# Altium schematic sheet CONFIG_MCU.SchDoc
size B; SheetNumber: 4; SheetTotal: 4
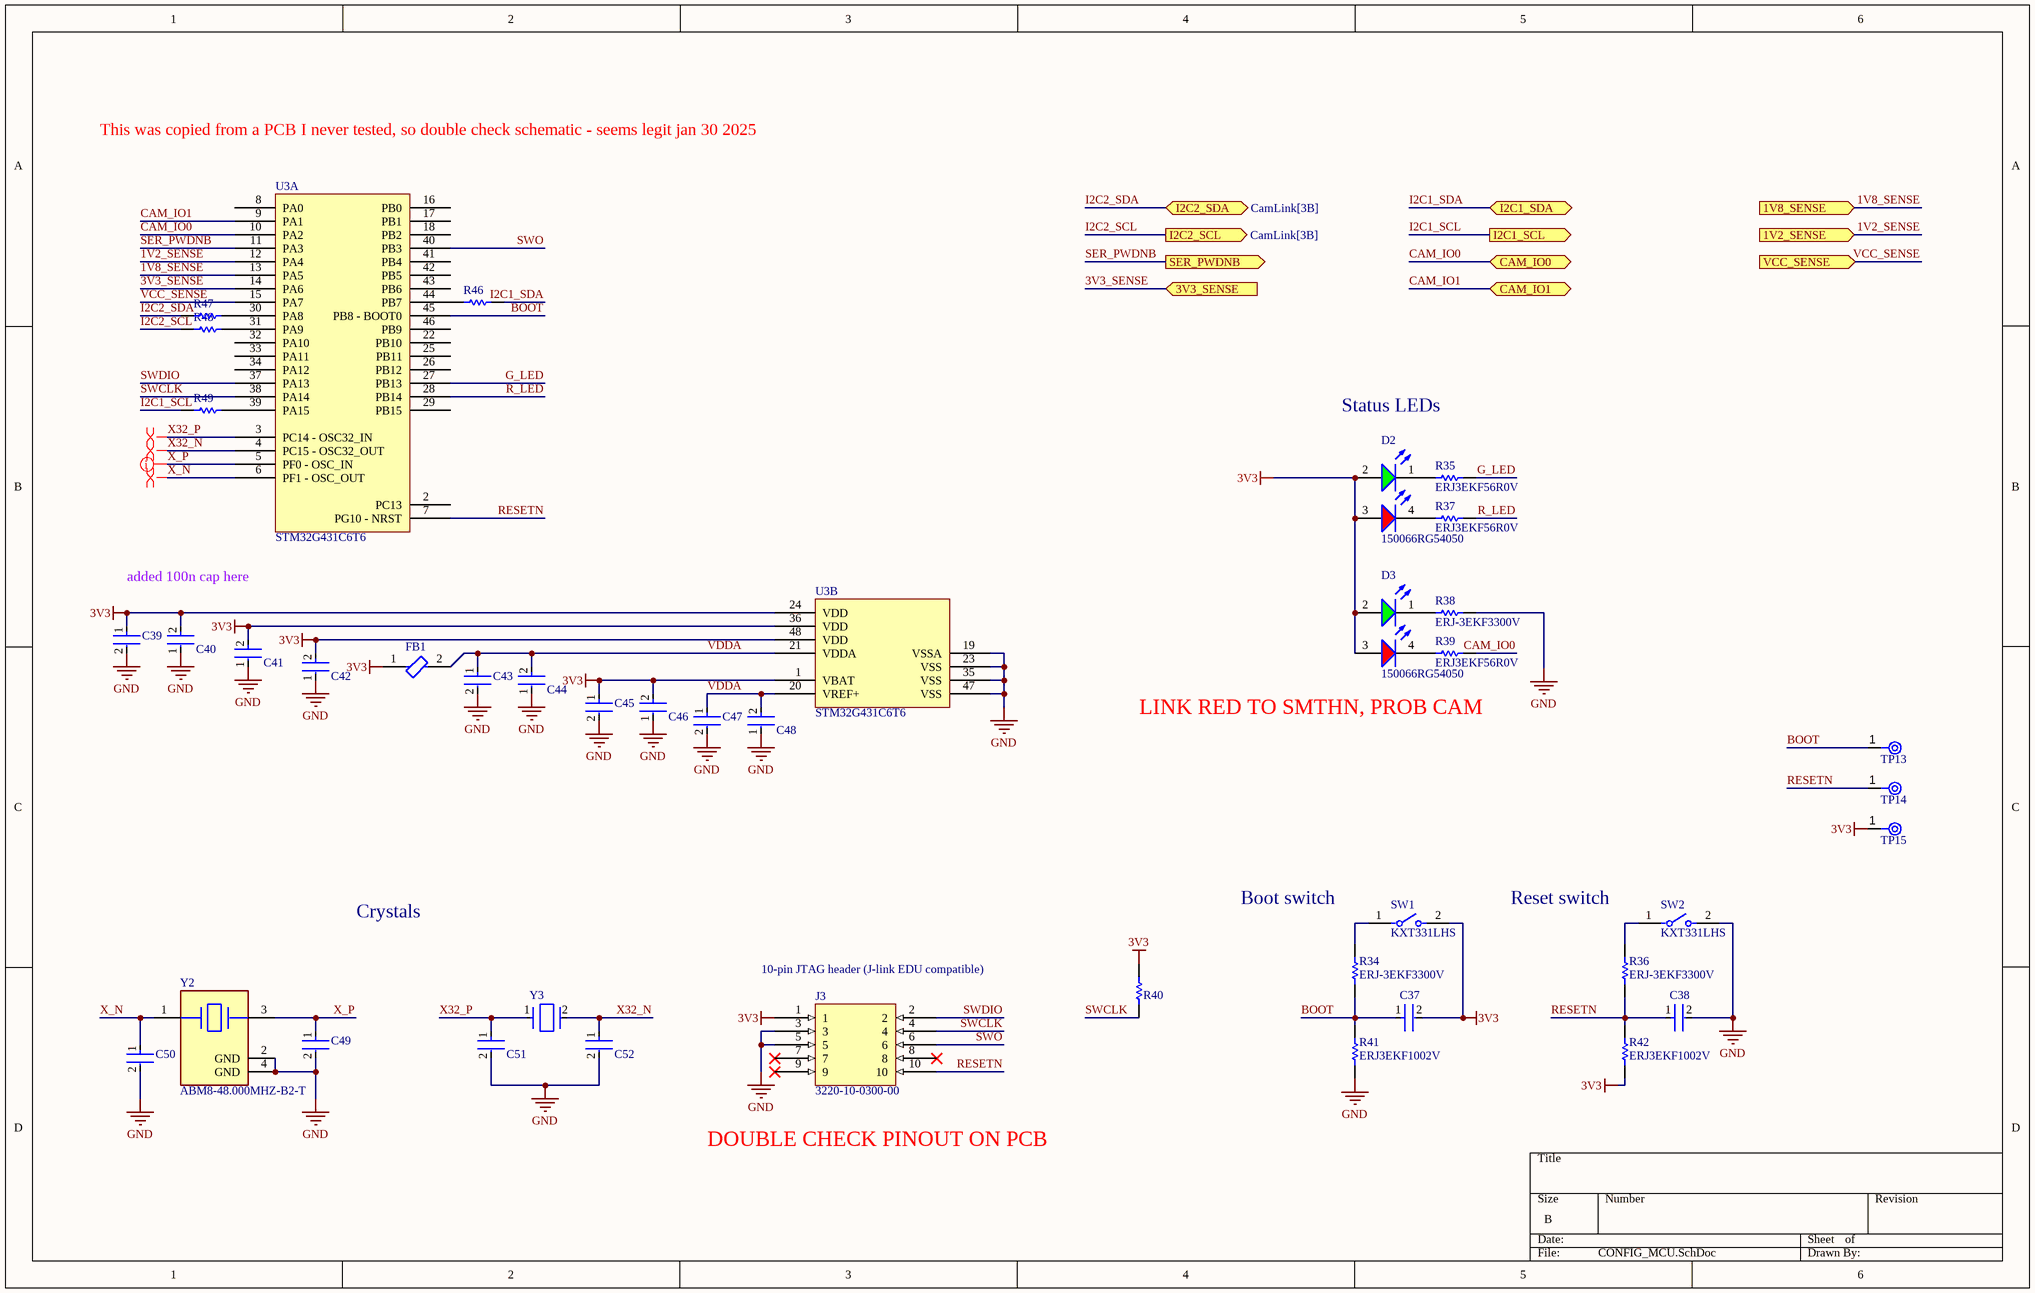
[diagram p0: CONFIG_MCU.SchDoc]

## Parts
C37  C0402C104K8PACTU  [FP-C0402-BB-MFG]  (value not drawn)
C38  C0402C104K8PACTU  [FP-C0402-BB-MFG]  (value not drawn)
C39  C1005X5R1A475K050BC  [FP-C1005-050-0_15-MFG]  (value not drawn)
C40  GRM155R71C104KA88D  [FP-GRM15-MFG]  (value not drawn)
C41  GRM155R71C104KA88D  [FP-GRM15-MFG]  (value not drawn)
C42  GRM155R71C104KA88D  [FP-GRM15-MFG]  (value not drawn)
C43  EMK105BJ105KV-F  [FP-0402-L_1_0_0_05-W_0_5-IPC_A]  (value not drawn)
C44  GRM155R71C104KA88D  [FP-GRM15-MFG]  (value not drawn)
C45  EMK105BJ105KV-F  [FP-0402-L_1_0_0_05-W_0_5-IPC_A]  (value not drawn)
C46  GRM155R71C104KA88D  [FP-GRM15-MFG]  (value not drawn)
C47  EMK105BJ105KV-F  [FP-0402-L_1_0_0_05-W_0_5-IPC_A]  (value not drawn)
C48  GRM155R71C104KA88D  [FP-GRM15-MFG]  (value not drawn)
C49  C0402C689C5GACTU  [FP-C0402-BB-MFG]  (value not drawn)
C50  C0402C689C5GACTU  [FP-C0402-BB-MFG]  (value not drawn)
C51  04025A180FAT2A  [FP-0402-L_1_0_1-W_0_5_0_1-IPC_A]  (value not drawn)
C52  04025A180FAT2A  [FP-0402-L_1_0_1-W_0_5_0_1-IPC_A]  (value not drawn)
D2  150066RG54050  [WL-SBCD_0606]
D3  150066RG54050  [WL-SBCD_0606]
FB1  BLM15PX601SN1D  [FP-BLM15-0_05-MFG]  (value not drawn)
J3  3220-10-0300-00  [3220-10-0300-00-Footprint-1]
R34  ERJ-3EKF3300V  [RESC1608X55X30LL15T15]
R35  ERJ3EKF56R0V  [RESC1608X55X30NL15T15]
R36  ERJ-3EKF3300V  [RESC1608X55X30LL15T15]
R37  ERJ3EKF56R0V  [RESC1608X55X30NL15T15]
R38  ERJ-3EKF3300V  [RESC1608X55X30LL15T15]
R39  ERJ3EKF56R0V  [RESC1608X55X30NL15T15]
R40  ERJ3EKF1002V  [RESC1609X55X30LL15T15]  (value not drawn)
R41  ERJ3EKF1002V  [RESC1609X55X30LL15T15]
R42  ERJ3EKF1002V  [RESC1609X55X30LL15T15]
R46  RC0402JR-070RL  [RESC1005X40X25NL05T10]  (value not drawn)
R47  RC0402JR-070RL  [RESC1005X40X25NL05T10]  (value not drawn)
R48  RC0402JR-070RL  [RESC1005X40X25NL05T10]  (value not drawn)
R49  RC0402JR-070RL  [RESC1005X40X25NL05T10]  (value not drawn)
SW1  KXT331LHS  [FP-KXT331LHS-MFG]
SW2  KXT331LHS  [FP-KXT331LHS-MFG]
TP13  TPAD6R  [New footprint 1]  (value not drawn)
TP14  TPAD6R  [New footprint 1]  (value not drawn)
TP15  TPAD6R  [New footprint 1]  (value not drawn)
U3  STM32G431C6T6  [TSQFP50P900X900X160-48N]  (parts A,B of 2)
Y2  ABM8-48.000MHZ-B2-T  [FP-ABM8-MFG]
Y3  ECS-.327-12.5-1210-TR  [FP-ECX-1210-MFG]  (value not drawn)

## Ports
1V2_SENSE (in, see CamLink[3B], GMSL_SERIALIZER[1B]), 1V8_SENSE (in, see CamLink[3B], GMSL_SERIALIZER[1B]), 3V3_SENSE (in, see CamLink[3B], 3V3_REG[3B]), CAM_IO0 (bidir, see CamLink[3B]), CAM_IO1 (bidir, see CamLink[3B]), I2C1_SCL (out, see CamLink[3B]), I2C1_SDA (bidir, see CamLink[3B]), I2C2_SCL (out, see CamLink[3B]), I2C2_SDA (bidir, see CamLink[3B]), SER_PWDNB (out, see CamLink[3B]), VCC_SENSE (in, see CamLink[3B], GMSL_SERIALIZER[1B])

## Nets
3V3: C37.2 C39.1 C40.2 C41.2 C42.2 C45.1 C46.2 D2.2(A) D2.3(A) D3.2(A) D3.3(A) FB1.1 J3.1 R40.1 R42.1 SW1.2 TP15.1(TP) U3.1(VBAT) U3.24(VDD) U3.36(VDD) U3.48(VDD)
GND: C38.2 C39.2 C40.1 C41.1 C42.1 C43.2 C44.1 C45.2 C46.1 C47.2 C48.1 C49.2 C50.2 C51.2 C52.2 J3.3 J3.5 R38.2 R41.1 SW2.2 U3.19(VSSA) U3.23(VSS) U3.35(VSS) U3.47(VSS) Y2.2(GND) Y2.4(GND)
1V2_SENSE: U3.12(PA4) ; port 1V2_SENSE
1V8_SENSE: U3.13(PA5) ; port 1V8_SENSE
3V3_SENSE: U3.14(PA6) ; port 3V3_SENSE
BOOT: C37.1 R34.1 R41.2 TP13.1(TP) U3.45(PB8_-_BOOT0)
CAM_IO0: R39.1 U3.10(PA2) ; port CAM_IO0
CAM_IO1: U3.9(PA1) ; port CAM_IO1
G_LED: R35.1 U3.27(PB13)
I2C1_SCL: R49.1 ; port I2C1_SCL
I2C1_SDA: R46.2 ; port I2C1_SDA
I2C2_SCL: R48.1 ; port I2C2_SCL
I2C2_SDA: R47.1 ; port I2C2_SDA
R_LED: R37.1 U3.28(PB14)
RESETN: C38.1 J3.10 R36.1 R42.2 TP14.1(TP) U3.7(PG10_-_NRST)
SER_PWDNB: U3.11(PA3) ; port SER_PWDNB
SWCLK: J3.4 R40.2 U3.38(PA14)
SWDIO: J3.2 U3.37(PA13)
SWO: J3.6 U3.40(PB3)
VCC_SENSE: U3.15(PA7) ; port VCC_SENSE
VDDA: C43.1 C44.2 C47.1 C48.2 FB1.2 U3.20(VREF+) U3.21(VDDA)
X32_N: C52.1 U3.4(PC15_-_OSC32_OUT) Y3.2(Out/In)
X32_P: C51.1 U3.3(PC14_-_OSC32_IN) Y3.1(In/Out)
X_N: C50.1 U3.6(PF1_-_OSC_OUT) Y2.1
X_P: C49.1 U3.5(PF0_-_OSC_IN) Y2.3
NetD2_1: D2.1(K) R35.2
NetD2_4: D2.4(K) R37.2
NetD3_1: D3.1(K) R38.1
NetD3_4: D3.4(K) R39.2
NetR34_2: R34.2 SW1.1
NetR36_2: R36.2 SW2.1
NetR46_1: R46.1 U3.44(PB7)
NetR47_2: R47.2 U3.30(PA8)
NetR48_2: R48.2 U3.31(PA9)
NetR49_2: R49.2 U3.39(PA15)

Not connected (* = marked no-connect by the designer): J3 7* 8* 9*; U3 2(PC13) 8(PA0) 16(PB0) 17(PB1) 18(PB2) 22(PB10) 25(PB11) 26(PB12) 29(PB15) 32(PA10) 33(PA11) 34(PA12) 41(PB4) 42(PB5) 43(PB6) 46(PB9)

## Layout directives
differential pair: X32_N, X32_P, X_N, X_P

## Notes on the sheet
- This was copied from a PCB I never tested, so double check schematic - seems legit jan 30 2025
- Status LEDs
- added 100n cap here
- LINK RED TO SMTHN, PROB CAM
- Boot switch
- Reset switch
- Crystals
- (near J3) 10-pin JTAG header (J-link EDU compatible)
- DOUBLE CHECK PINOUT ON PCB

## Library data of the parts
C37 C38 = CMP-2008-02046-2: CAP CER 0.1UF 10V X5R 0402; Manufacturer: Kemet; Material: Ceramic; Capacitance: 0.10 μF; Temperature Coefficient: 15%; Tolerance: 0.1; Value: 0.10 μF; Package: C0402-BB; Temperature: -55°C to +125°C; ComponentLink2Description: Datasheet; Temperature Characteristic: X5R; Device Class L1: Passive Components; Height: 0.55mm; Lead Free: Yes; ComponentLink2URL: https://content.kemet.com/datasheets/KEM_C1002_X7R_SMD.pdf; Device Class L2: Capacitors; Temperature Range Low: -55°C; Temperature Range High: +125°C; RoHS: TRUE; Octopart: https://octopart.com/c0402c104k8pactu-kemet-140039; Automotive: No; Mouser Description: Capacitor 100 nF 10 VDC 0402; Category: Cap; Voltage Rating: 10 V; Digikey Description: CAP CER 0.1UF 10V X5R 0402; Ipc Land Pattern Name: CAPC10050X50; Device Class L3: Ceramic Capacitors; Manufacturer Part Number: C0402C104K8PACTU
C39 = CMP-2000-05997-2: CAP CER 4.7UF 10V X5R 0402; Dielectric Material: Ceramic; Tolerance: 10%; Series: C; Package Quantity: 10000; Max Operating Temperature: 85°C; Case Code (Imperial): 0402; Lead Free: Lead Free; Voltage Rating (DC): 10V; Packaging: Cut Tape; Voltage Rating: 10V; Min Operating Temperature: -55°C; Dielectric: X5R; Thickness: 0.022inch; Width: 0.02inch; Case/Package: 0402; Case Code (Metric): 1005; Capacitance: 4.7uF; Length: 0.039inch; RoHS Compliant: Yes; REACH SVHC: No SVHC; Mount: Surface Mount
C40-C42 C44 C46 C48 = CMP-2100-03641-2: CAP CER 0.1UF 16V X7R 0402; Manufacturer: Murata; Standoff Height: 0mm; Tolerance: 10%; Voltage Rating: 16Vdc; Material: Ceramic; Capacitance: 0.10μF; Value: 0.10μF; RoHS: TRUE; Manufacturer Part Number: GRM155R71C104KA88D; Temperature Characteristic: X7R; Octopart: https://octopart.com/grm155r71c104ka88d-murata-196880; Digikey Description: CAP CER 0.1UF 16V X7R 0402; Device Class L3: Ceramic Capacitors; Height: 0.55mm; ComponentLink2Description: Datasheet; Temperature Range Low: -55°C; Ipc Land Pattern Name: CAPC10050X219; ComponentLink2URL: https://search.murata.co.jp/Ceramy/image/img/A01X/G101/ENG/GRM155R71H471KA01-01A.pdf; Device Class L1: Passive Components; Lead Free: yes; Category: Cap; Package: GRM15; Temperature: -55°C to +125°C; Device Class L2: Capacitors; Temperature Range High: +125°C; Mouser Description: 0402 0.1 uF 16V ±10 % Tolerance X7R SMT Multilayer Ceramic Capacitor
C43 C45 C47 = CMP-14477-000104-2: None; Tolerance: 10%; Voltage Rating: 16V; Dielectric: X5R; Capacitance: 1uF; Packaging: Tape and Reel; Depth: 0.5mm; Mount: Surface Mount; Thickness: 0.022inch; Package Quantity: 1; Min Operating Temperature: -55°C; Series: M; Voltage Rating (DC): 16V; Termination: SMD/SMT; Case/Package: 0402; Number of Pins: 2; Case Code (Imperial): 0402; Length: 1mm; Halogen Free: Halogen Free; Case Code (Metric): 1005; Width: 0.02inch; RoHS Compliant: Yes; Radiation Hardening: No; Max Operating Temperature: 85°C; Height: 0.5mm; Construction: Flat
C49 C50 = CMP-1034-00517-3: CAP CER 6.8PF 50V NP0 0402; Manufacturer: Kemet; Material: Ceramic; Temperature Characteristic: C0G; Tolerance: 0.25 pF; Temperature Coefficient: 15%; ComponentLink2URL: https://content.kemet.com/datasheets/KEM_C1002_X7R_SMD.pdf; Octopart: https://octopart.com/c0402c689c5gactu-kemet-9143567; RoHS: TRUE; Temperature: -55°C to +125°C; Device Class L2: Capacitors; ComponentLink2Description: Datasheet; Mouser Description: Cap Ceramic 6.8pF 50V C0G 0.25pF SMD 0402 125°C Paper T/R; Device Class L3: Ceramic Capacitors; Digikey Description: CAP CER 6.8PF 50V NP0 0402; Temperature Range High: +125°C; Package: C0402-BB; Voltage Rating: 50 V; Height: 0.55mm; Ipc Land Pattern Name: CAPC10050X50; Value: 6.8 pF; Device Class L1: Passive Components; Category: Cap; Manufacturer Part Number: C0402C689C5GACTU; Capacitance: 6.8 pF; Lead Free: Yes; Automotive: No; Temperature Range Low: -55°C
C51 C52 = CMP-2008-02590-2: General Purpose Ceramic Capacitor, 0402, 18pF, 1%, C0G, 30ppm/°C, 50V; Depth: 0.5mm; Packaging: Tape and Reel; Number of Pins: 2; Tolerance: 1%; Min Operating Temperature: -55°C; Capacitance: 18pF; Termination: SMD/SMT; Lead Free: Lead Free; Case Code (Metric): 1005; Radiation Hardening: No; Package Quantity: 1; Max Operating Temperature: 125°C; Voltage Rating: 50V; Construction: Flat; Dielectric: C0G; Length: 1mm; REACH SVHC: No SVHC; Case Code (Imperial): 0402; Series: -; RoHS Compliant: Yes; Voltage Rating (DC): 50V; Mount: Surface Mount; Case/Package: 0402; Width: 0.5mm; Thickness: 0.022inch; Contact Plating: Tin
D2 D3 = CMP-004-00040-2: Led, Red/Grn, 180Mcd/230Mcd, 624Nm/525Nm Rohs Compliant: Yes; Source: rgled.SchLib; Component Type: Standard; Design Item ID: CMP-004-00034-2; Pins: 4
FB1 = CMP-0686-00252-4: Chip Ferrite Bead, 0402, 600Ω @ 100MHz, 0.23Ω, 25%, 900mA; Number of Circuits: 1; Impedance: 600R; DC Resistance (DCR): 230mR; Material: Steel; Length: 1mm; Package Quantity: 10000; Height: 0.5mm; Width: 0.5mm; Max DC Current: 900mA; Number of Lines: 1; Termination: SMD/SMT; Packaging: Tape and Reel; Lead Free: Lead Free; Min Operating Temperature: -55°C; Max Operating Temperature: 125°C; Max Current Rating: 900mA; Case Code (Imperial): 0402; Number of Pins: 2; Current Rating: 900mA; Test Frequency: 100MHz; Case/Package: 0402; Tolerance: 25%; Case Code (Metric): 1005
J3 = CMP-001-0013-3: CONN HEADER SMD 10POS 1.27MM
R34 R36 R38 = CMP-2000-00435-2: Chip Resistor, 330 Ohm, +/- 1%, 0.1 W, -55 to 155 degC, 0603 (1608 Metric), RoHS, Tape and Reel; Gender: Male; Mating Cycles: 10000; Current Rating: 500 mA; Voltage Rating: 10 V; REACH SVHC: No SVHC; PackageDescription: 2-Pin Surface Mount Device, Body 1.6 x 0.85 mm; Contact Finish: Gold; Pins: 8; ComponentLink1Description: Manufacturer URL; Packaging: Tape and Reel; Max Operating Temperature: 85 degC; Contact Material: Copper; Height: 1.45 mm; Width: 1.45 mm; DatasheetVersion: Apr-15; Package Quantity: 1500; Contact Plating: Gold; PackageReference: 0603; Mount: Surface Mount; Lead Pitch: 1.1 mm; Min Operating Temperature: -25 degC; ComponentLink1URL: http://www.panasonic.com/; ComponentLink2URL: http://industrial.panasonic.com/cdbs/www-data/pdf/RDA0000/AOA0000C86.pdf; Length: 13.7 mm; ComponentLink2Description: Datasheet; RoHSCompliant: true
R35 R37 R39 = CMP-2000-00572-1: Manufacturer: Panasonic; Part Number: ERJ3EKF56R0V
R40-R42 = CMP-1012-00623-3: Chip Resistor, 10 KOhm, +/- 1%, 0.1 W, -55 to 155 degC, 0603 (1608 Metric), RoHS, Tape and Reel; Manufacturer: Panasonic; Voltage Rating: 75V; Case\/Package: 0603; Power Rating: 100mW; Resistance: 10KOhm; Temperature Coefficient: 100ppm\/degreesC; Number of Pins: 2; Package Reference: 603; Depth: 0.8mm; Mount: SurfaceMount; Package Description: 2-Pin Surface Mount Device, Body 1.6 x 0.85 mm; Datasheet Version: 02/2017; Length: 1.6mm; Lead Free: LeadFree; Height: 0.45mm; Number of Terminations: 2; Max Power Dissipation: 100mW; Min Operating Temperature: -55degC; Datasheet URL: https://industrial.panasonic.com/cdbs/www-data/pdf/RDA0000/AOA0000C304.pdf; Termination: SMD/SMT; Case Code (Metric): 1608; Case Code (Imperial): 0603; Tolerance: 1%; Max Operating Temperature: 155degC; RoHSCompliant: true; Voltage Rating (DC): 75V; Radiation Hardening: No; Packaging: TapeandReel; Composition: ThickFilm; Mounting Technology: SurfaceMount; Manufacturer URL: http://www.panasonic.com/; Width: 0.031inch; REACH SVHC: NoSVHC; Contact Plating: Tin; Military Standard: Not; Package Quantity: 1
R46-R49 = CMP-1011-00001-2: Manufacturer: Yageo / Phycomp; Part Number: RC0402JR-070RL
SW1 SW2 = CMP-10040-000029-1: SWITCH TACTILE SPST-NO 0.02A 15V; Operating Force: 240gf; Switch Travel: 0.13mm; Illumination Type: Non-Illuminated; Throw Configuration: SPST; Number of Ports: 1; Current Rating: 5A; Mechanical Life: 500000Cycles; Switch Function: Off-Mom; Connector Type: USB; Actuator Type: Standard; Gender: Receptacle; Number of Contacts: 24; Contact Plating: Gold; Insulation Color: Black; Min Operating Temperature: -40°C; Packaging: Tape and Reel; Flammability Rating: UL94 V-0; Max Operating Temperature: 85°C; Termination: Solder; Mount: Surface Mount
TP13-TP15 = CMP-00025-2: Test Point .6mm
U3 = CMP-020-00017-1: IC MCU 32BIT 32KB FLASH 48LQFP; RoHS Compliant: Yes
Y2 = CMP-27762-011708-1: Crystal 48MHz ±20ppm 18pF SMD-4 3.2mm x 2.5mm; Series Resistance: 35R; Frequency Stability: 50ppm; Package Quantity: 1000; Packaging: Tape and Reel; Mount: Surface Mount; Length: 3.2mm; Load Capacitance: 18pF; Max Operating Temperature: 70°C; Operating Frequency: 48 MHz; RoHS Compliant: Yes; Series: ABM8; Frequency Tolerance: 20ppm; Lead Free: Lead Free; Min Operating Temperature: -20°C; Case/Package: CSMD; Number of Pins: 4; Height: 0.031inch; ESR (Equivalent Series Resistance): 35R; Frequency: 48MHz; Radiation Hardening: No; Width: 0.098inch; Tolerance: 20ppm; Termination: SMD/SMT; Depth: 2.5mm; Resistor Type: Ceramic; REACH SVHC: No SVHC
Y3 = CMP-40224-000006-1: CRYSTAL 32.7680KHZ 12.5PF SMD; Manufacturer: ECS International; Frequency: 32.768kHz; Esr: 90kΩ; Tolerance: 20ppm; Device Class L1: Passive Components; Load Capacitance: 12.5pF; Temperature: -40°C to +85°C; ComponentLink2URL: https://ecsxtal.com/store/pdf/ECX-1210.pdf; Series: ECX-1210; Octopart: https://octopart.com/ecs-.327-12.5-1210-tr-ecs+international-81221340; ComponentLink2Description: Datasheet; Temperature Range Low: -40°C; Digikey Description: CRYSTAL 32.7680KHZ 12.5PF SMD; Lead Free: Yes; RoHS: TRUE; Device Class L3: Crystals; Automotive: No; Category: Crys; Height: 0.5mm; Manufacturer Part Number: ECS-.327-12.5-1210-TR; Temperature Range High: +85°C; Device Class L2: Crystals / Oscillators; Package: ECX-1210